# EAGLE design task8 (EAGLE 9.5.1)
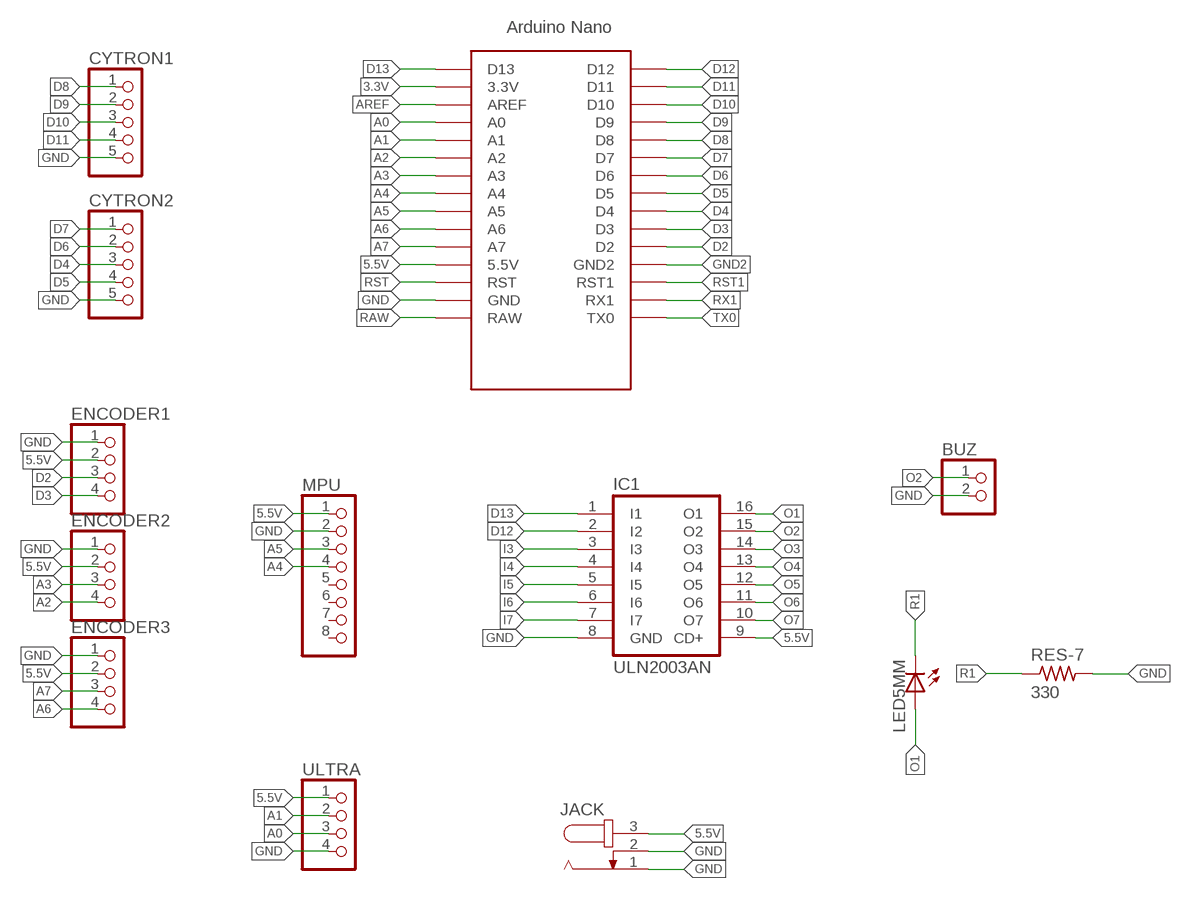
[diagram p0: schematic, sheet 1]

## Parts
330  RES-7  [0204/7]
BUZ  PINHD-1X2  [1X02]
CYTRON1  PINHD-1X5  [1X05]
CYTRON2  PINHD-1X5  [1X05]
ENCODER1  PINHD-1X4  [1X04]
ENCODER2  PINHD-1X4  [1X04]
ENCODER3  PINHD-1X4  [1X04]
IC1  ULN2003AN  [DIL16]
JACK  JACK-PLUG0  [SPC4077]
MPU  PINHD-1X8  [1X08]
U$1  ARDUINO_NANO  [NANO]
U$3  LED5MM  [LED5MM]
ULTRA  PINHD-1X4  [1X04]

## Nets
3.3V: U$1.3.3V
5.5V: ENCODER1.2 ENCODER2.2 ENCODER3.2 IC1.9(CD+) JACK.3 MPU.1 U$1.5V(5.5V) ULTRA.1
A0: U$1.A0 ULTRA.3
A1: U$1.A1 ULTRA.2
A2: ENCODER2.4 U$1.A2
A3: ENCODER2.3 U$1.A3
A4: MPU.4 U$1.A4
A5: MPU.3 U$1.A5
A6: ENCODER3.4 U$1.A6
A7: ENCODER3.3 U$1.A7
AREF: U$1.AREF
D2: ENCODER1.3 U$1.D2
D3: ENCODER1.4 U$1.D3
D4: CYTRON2.3 U$1.D4
D5: CYTRON2.4 U$1.D5
D6: CYTRON2.2 U$1.D6
D7: CYTRON2.1 U$1.D7
D8: CYTRON1.1 U$1.D8
D9: CYTRON1.2 U$1.D9
D10: CYTRON1.3 U$1.D10
D11: CYTRON1.4 U$1.D11
D12: IC1.2(I2) U$1.D12
D13: IC1.1(I1) U$1.D13
GND: 330.2 BUZ.2 CYTRON1.5 CYTRON2.5 ENCODER1.1 ENCODER2.1 ENCODER3.1 IC1.8(GND) JACK.1 JACK.2 MPU.2 U$1.GND ULTRA.4
GND2: U$1.GND1(GND2)
I3: IC1.3(I3)
I4: IC1.4(I4)
I5: IC1.5(I5)
I6: IC1.6(I6)
I7: IC1.7(I7)
O1: IC1.16(O1) U$3.A
O2: BUZ.1 IC1.15(O2)
O3: IC1.14(O3)
O4: IC1.13(O4)
O5: IC1.12(O5)
O6: IC1.11(O6)
O7: IC1.10(O7)
R1: 330.1 U$3.K(C)
RAW: U$1.RAW
RST: U$1.RST
RST1: U$1.RST1
RX1: U$1.RX1
TX0: U$1.TX0
Unconnected: MPU.5 MPU.6 MPU.7 MPU.8

## Library data of the parts
330 = MIA-Training:RES-7
BUZ = MIA-Training:PINHD-1X2: PIN HEADER
CYTRON1 CYTRON2 = MIA-Training:PINHD-1X5: PIN HEADER
ENCODER1-ENCODER3 ULTRA = MIA-Training:PINHD-1X4: PIN HEADER
IC1 = MIA-Training:ULN2003A: DRIVER ARRAY
JACK = con-jack:JACK-PLUG: DC POWER JACK Power Jack, DC, Right Angle, Through Hole, Rated 5A at 16VDC, PC Terminals Distributor: Farnell (www.Farnell.de) Drawing: 84N1161.pdf / 84N1162.pdf Manufacturer: SPC Technology (www.spctechnology.com) Type: SPC4077 / SPC 4078; OC_FARNELL: unknown; OC_NEWARK: unknown
MPU = MIA-Training:PINHD-1X8: PIN HEADER
U$1 = MIA-Training:ARDUINO_NANO: Arduino Nano
U$3 = MIA-Training:LED5MM

## Board
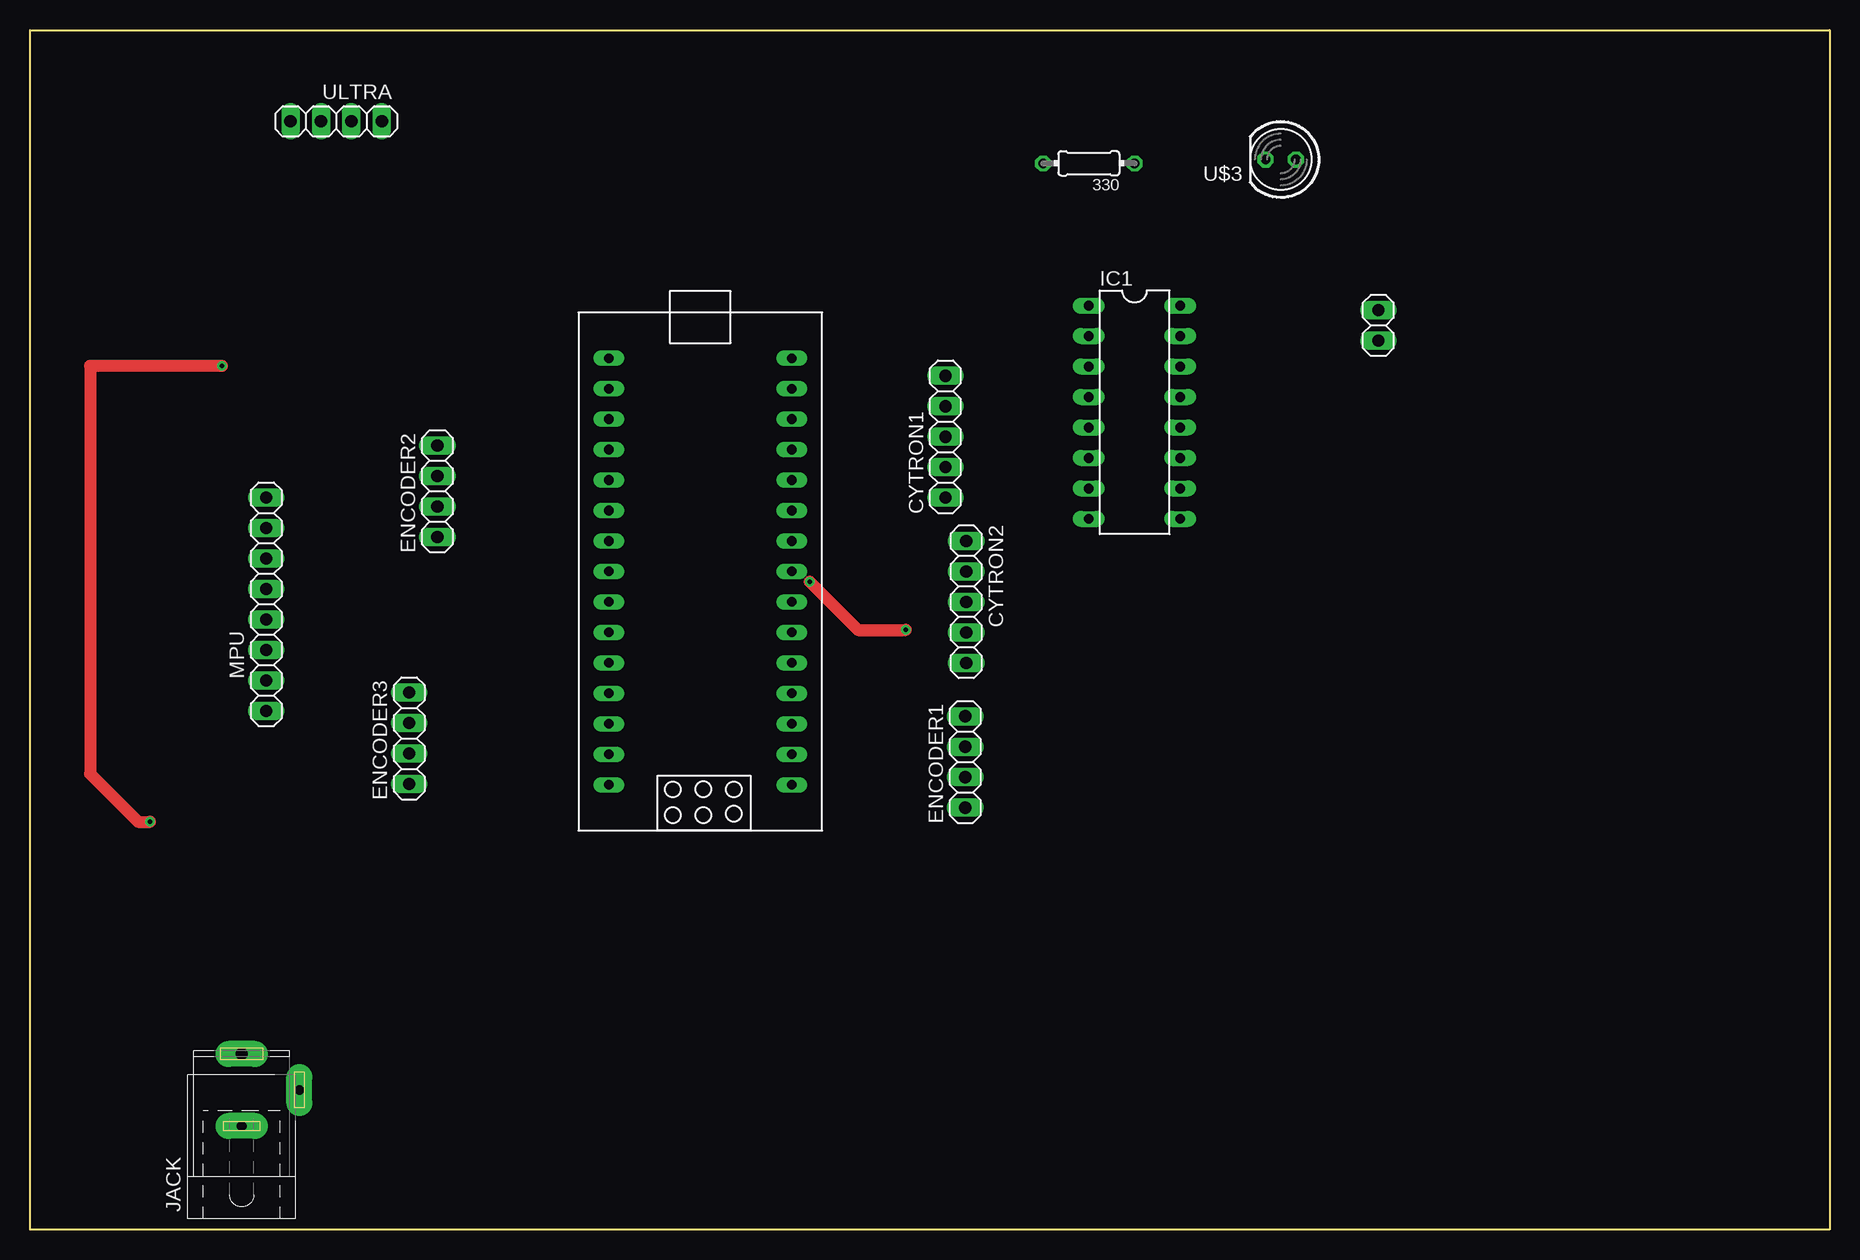
[diagram p1: board, top side]
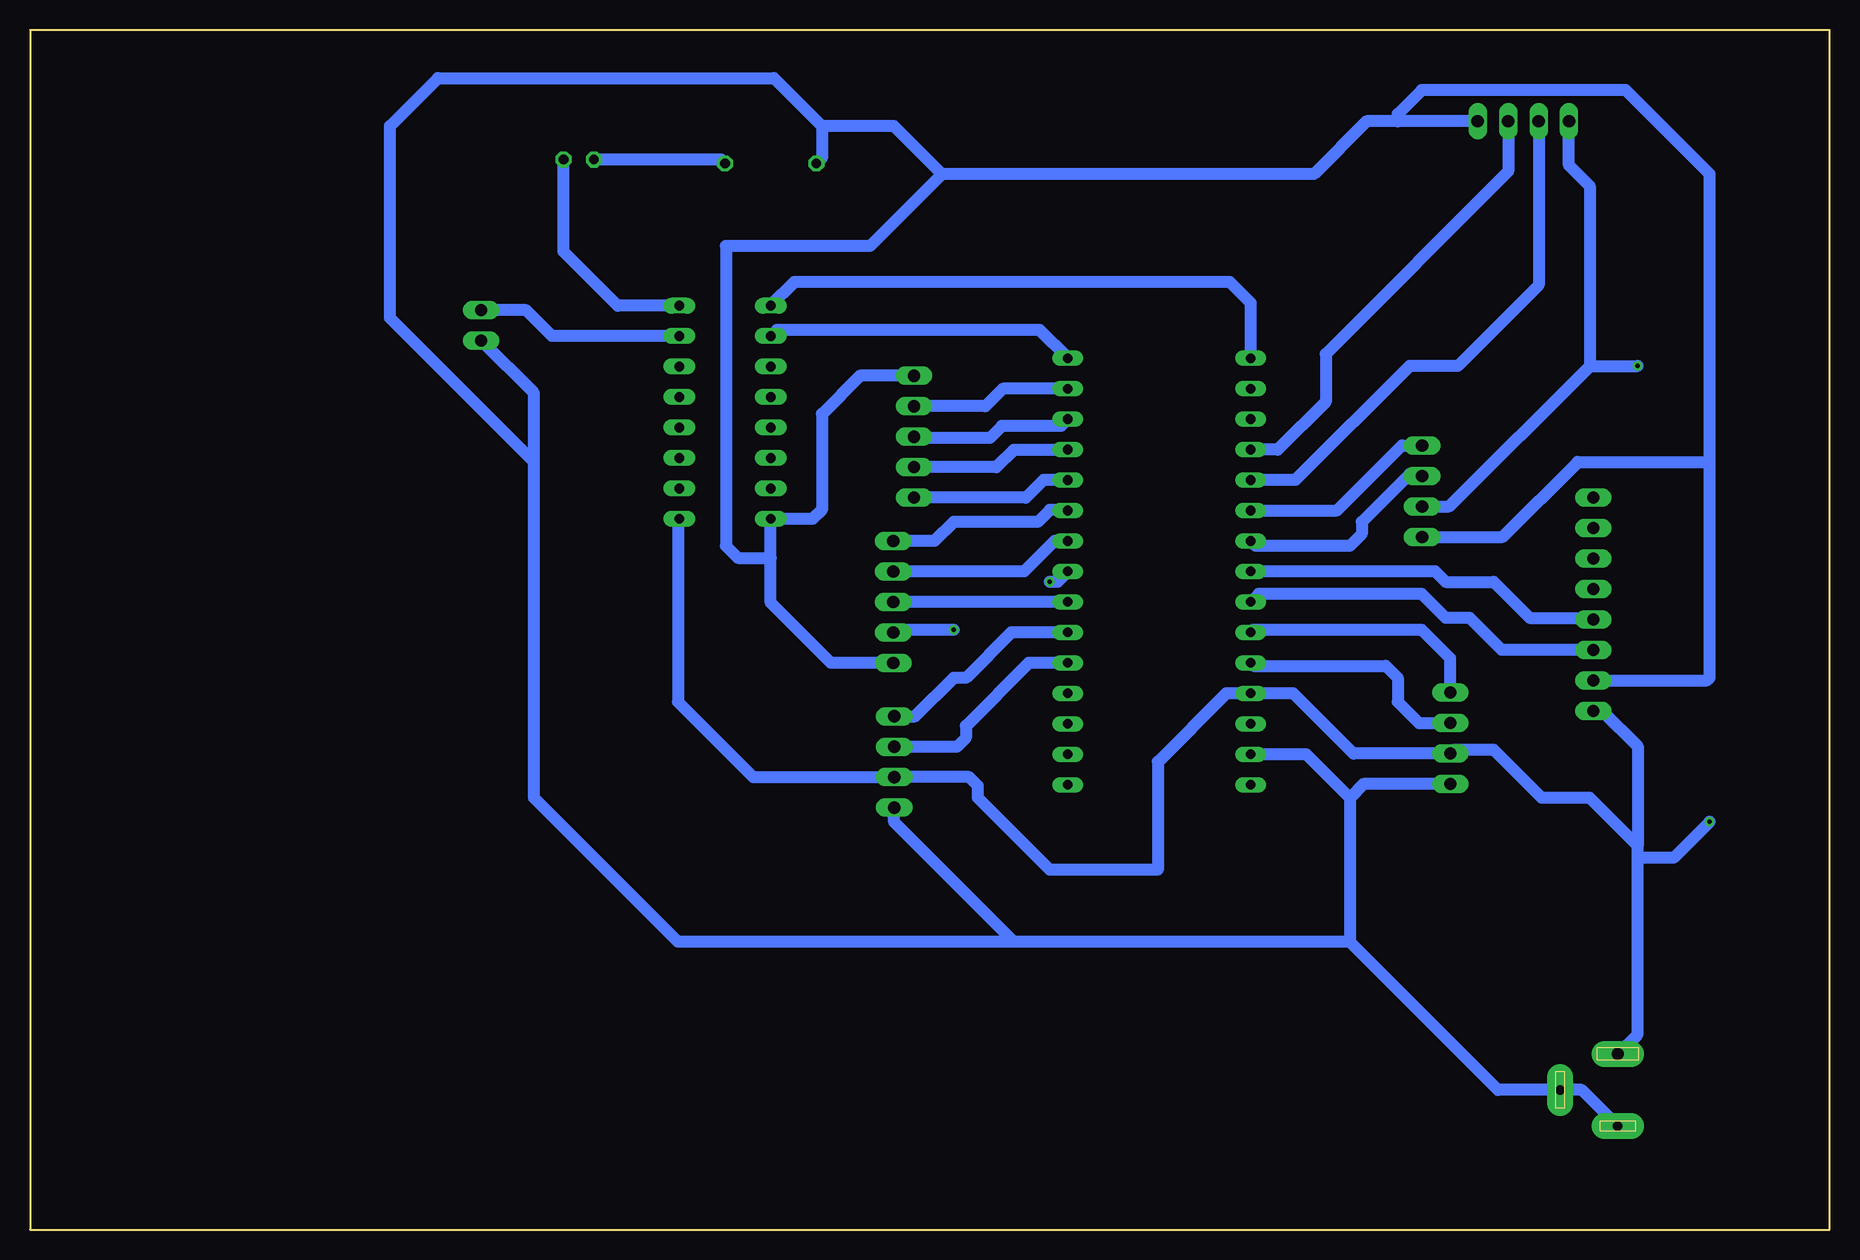
[diagram p2: board, bottom side, seen from below]

Size 150 x 100 mm. Coordinates in mm from the lower left corner, seen from the top.
Outline: 0,0 0,100 150,100 150,0 0,0
Copper layers (1*16): Top 0.035mm / dielectric 1.5mm / Bottom 0.035mm
Design rules "default": minimum track width 6mil, minimum drill 0.35mm, track to track 6mil, track to pad 6mil, pad to pad 6mil, via to via 6mil, smd to smd 6mil, copper to edge 40mil, drill to drill 6mil, minimum pad ring 10mil, minimum via ring 8mil, stop-mask expansion 4mil, vias tented up to drill 0mil, thermal gap 10mil

### Footprints (pad centres in the part's own frame; a part is rotated, then mirrored left to right if it is on the bottom)
0204/7 = drill 0.813 octagon: 1 -3.81,0; 2 3.81,0
1X02 = drill 1.016 long: 1 -1.27,0; 2 1.27,0
1X05 = drill 1.016 long: 1 -5.08,0; 2 -2.54,0; 3 0,0; 4 2.54,0; 5 5.08,0
1X04 = drill 1.016 long: 1 -3.81,0; 2 -1.27,0; 3 1.27,0; 4 3.81,0
DIL16 = drill 0.813 long: 1 -8.89,-3.81; 2 -6.35,-3.81; 3 -3.81,-3.81; 4 -1.27,-3.81; 5 1.27,-3.81; 6 3.81,-3.81; 7 6.35,-3.81; 8 8.89,-3.81; 9 8.89,3.81; 10 6.35,3.81; 11 3.81,3.81; 12 1.27,3.81; 13 -1.27,3.81; 14 -3.81,3.81; 15 -6.35,3.81; 16 -8.89,3.81
SPC4077 = drill 0.8 pad 2.184 long: 1 -3,0; 2 0,-4.8 | drill 1 pad 2.184 long: 3 3,0
1X08 = drill 1.016 long: 1 -8.89,0; 2 -6.35,0; 3 -3.81,0; 4 -1.27,0; 5 1.27,0; 6 3.81,0; 7 6.35,0; 8 8.89,0
NANO = drill 0.8 long: 3.3V -10.16,24.13; 5V -10.16,-1.27; A0 -10.16,19.05; A1 -10.16,16.51; A2 -10.16,13.97; A3 -10.16,11.43; A4 -10.16,8.89; A5 -10.16,6.35; A6 -10.16,3.81; A7 -10.16,1.27; AREF -10.16,21.59; D2 5.08,1.27; D3 5.08,3.81; D4 5.08,6.35; D5 5.08,8.89; D6 5.08,11.43; D7 5.08,13.97; D8 5.08,16.51; D9 5.08,19.05; D10 5.08,21.59; D11 5.08,24.13; D12 5.08,26.67; D13 -10.16,26.67; GND -10.16,-6.35; GND1 5.08,-1.27; RAW -10.16,-8.89; RST -10.16,-3.81; RST1 5.08,-3.81; RX1 5.08,-6.35; TX0 5.08,-8.89
LED5MM = drill 0.813 octagon: A -1.27,0; K 1.27,0

### Placement (x,y rotation side)
330  88.26,88.88 180 top
BUZ  112.39,75.37 270 top
CYTRON1  76.31,66.09 90 top
CYTRON2  78.04,52.32 270 top
ENCODER1  77.96,38.98 90 top
ENCODER2  33.96,61.55 90 top
ENCODER3  31.61,40.95 90 top
IC1  92.07,68.13 270 top
JACK  17.65,11.63 90 top
MPU  19.69,52.13 90 top
U$1  58.41,45.97 0 top
U$3  104.26,89.2 180 top
ULTRA  25.52,92.39 0 top

### Tracks (layer width: path | path; a pad name or v marks a point on that pad's centre or on a via)
5.5V  (via drill 0.35)
  Top 1: v16,72 5,72 5,38 9,34 v10,34
  Bottom 1: IC1.9 96,59.12 96,44 89.71,37.71 ENCODER1.2 71.71,37.71 71,37 71,36 65,30 56,30 56,39 50.3,44.7 U$1.5V 44.7,44.7 39.68,39.68 ENCODER3.2 31.29,40 28,40 24,36 20,36 16,32 | JACK.3 16,16.28 16,31 | 16,31 16,32 | ENCODER2.2 31.72,60.28 20,72 | 20,72 20,87 21.71,88.71 ULTRA.1 | 20,72 v16,72 | v10,34 13,31 16,31 | MPU.1 18.93,43.24 16,40.31 16,32
A0
  Bottom 1: ULTRA.3 26.79,88.21 42,73 42,69 45.98,65.02 U$1.A0
A1
  Bottom 1: ULTRA.2 24.25,78.75 31,72 35,72 44.52,62.48 U$1.A1
A2
  Bottom 1: U$1.A2 41.06,59.94 35.64,65.36 ENCODER2.4
A3
  Bottom 1: ENCODER2.3 34.14,63 35,63 39,59 39,58 40,57 47.85,57 U$1.A3
A4
  Bottom 1: 48.11,55 U$1.A4 32.86,54.86 32,54 28,54 25,51 19.83,51 MPU.4
A5
  Bottom 1: MPU.3 27.32,48.32 30,51 32,51 34,53 47.57,53 U$1.A5
A6
  Bottom 1: ENCODER3.4 31.61,47.61 34,50 48.03,50 U$1.A6
A7
  Bottom 1: U$1.A7 48.01,47 37,47 36,46 36,44 34.22,42.22 ENCODER3.3
D2
  Bottom 1: ENCODER1.3 72.75,40.25 72,41 72,42 66.76,47.24 U$1.D2
D3
  Bottom 1: ENCODER1.4 76.21,42.79 73,46 72,46 68.22,49.78 U$1.D3
D4
  Bottom 1: U$1.D4 CYTRON2.3
D5  (via drill 0.35)
  Top 1: v65,54 69,50 v73,50
  Bottom 1: v73,50 77.82,50 CYTRON2.4 | U$1.D5 64.35,54 v65,54
D6
  Bottom 1: U$1.D6 64.6,57.4 67.14,54.86 CYTRON2.2
D7
  Bottom 1: CYTRON2.1 74.6,57.4 73,59 66,59 65,60 63.55,60 U$1.D7
D8
  Bottom 1: U$1.D8 65.52,62.48 66.99,61.01 CYTRON1.1
D9
  Bottom 1: U$1.D9 63.51,65 68,65 69.45,63.55 CYTRON1.2
D10
  Bottom 1: U$1.D10 64.05,67 69,67 70,66 76.22,66 CYTRON1.3
D11
  Bottom 1: U$1.D11 68.9,70.1 70.37,68.63 CYTRON1.4
D12
  Bottom 1: U$1.D12 65.85,75 87.74,75 IC1.2
D13
  Bottom 1: U$1.D13 48.25,77.25 50,79 86.28,79 IC1.1
GND
  Bottom 1: JACK.1 20.65,11.63 JACK.2 27.63,11.63 40,24 | 40,36 43.62,39.62 U$1.GND | 40,36 40,24 | 40,24 68,24 | ENCODER1.1 77.96,33.96 68,24 | 68,24 96,24 108,36 108,51 108,64 | BUZ.2 108,69.71 108,64 | CYTRON2.5 83.24,47.24 88.26,52.26 88.26,56 | 88.26,56 IC1.8 84.76,59.24 84,60 84,68 80.83,71.17 CYTRON1.5 | 108,64 120,76 120,92 116,96 88,96 84,92 | 330.2 84,89.33 84,92 | ENCODER3.1 38.86,37.14 40,36 | ULTRA.4 36,92.39 | 36,92.39 38.61,92.39 43,88 74,88 | 74,88 78,92 84,92 | MPU.2 10.22,45.78 10,46 10,64 | 36,92.39 36,93 34,95 17,95 10,88 10,64 | 10,64 21,64 27.26,57.74 ENCODER2.1 | 74,88 80,82 92,82 92,57 91,56 88.26,56
O1
  Bottom 1: IC1.16 101.02,77.02 105.53,81.53 U$3.A
O2
  Bottom 1: IC1.15 106.48,74.48 108.64,76.64 BUZ.1
R1
  Bottom 1: 330.1 92.39,89.2 U$3.K